# EAGLE design nRF24 Arduino adapter (EAGLE 6.6.0)
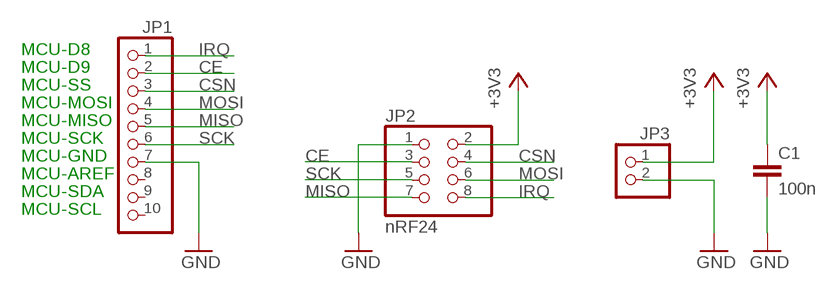
[diagram p0: schematic, sheet 1]

## Parts
C1  100n  C7.5/3  [C7.5B3]
JP1  PINHD-1X10  [1X10]
JP2  nRF24  PINHD-2X4  [2X04]
JP3  PINHD-1X2  [1X02]

## Nets
+3V3: C1.1 JP2.2 JP3.1
CE: JP1.2 JP2.3
CSN: JP1.3 JP2.4
GND: C1.2 JP1.7 JP2.1 JP3.2
IRQ: JP1.1 JP2.8
MISO: JP1.5 JP2.7
MOSI: JP1.4 JP2.6
SCK: JP1.6 JP2.5
Unconnected: JP1.8 JP1.9 JP1.10

## Notes on the sheet
- MCU-D8
- MCU-D9
- MCU-SS
- MCU-MOSI
- MCU-MISO
- MCU-SCK
- MCU-GND
- MCU-AREF
- MCU-SDA
- MCU-SCL

## Library data of the parts
C1 = capacitor-wima:C: CAPACITOR naming: grid - package width
JP1 = pinhead:PINHD-1X10: PIN HEADER
JP2 = pinhead:PINHD-2X4: PIN HEADER
JP3 = pinhead:PINHD-1X2: PIN HEADER

## Board
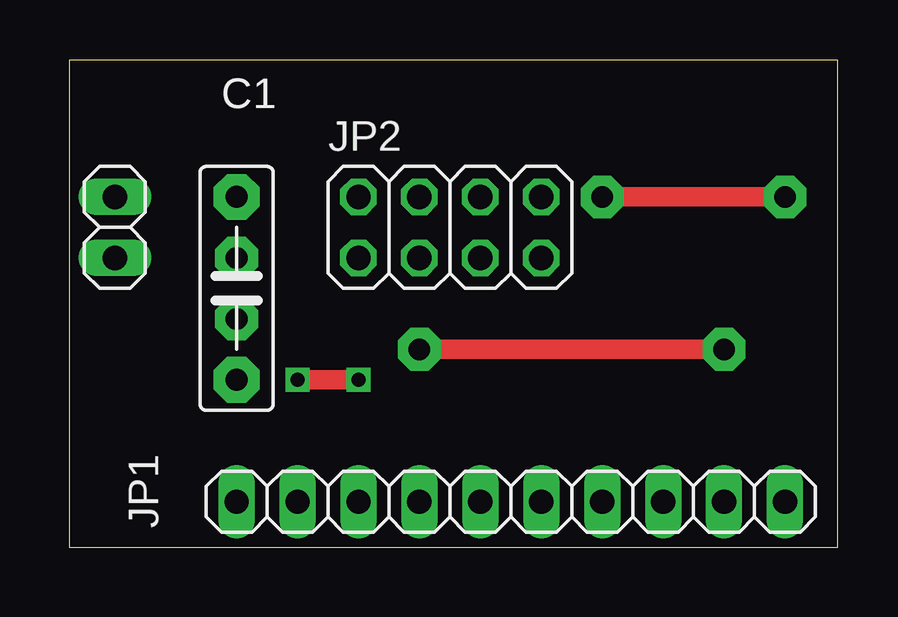
[diagram p1: board, top side]
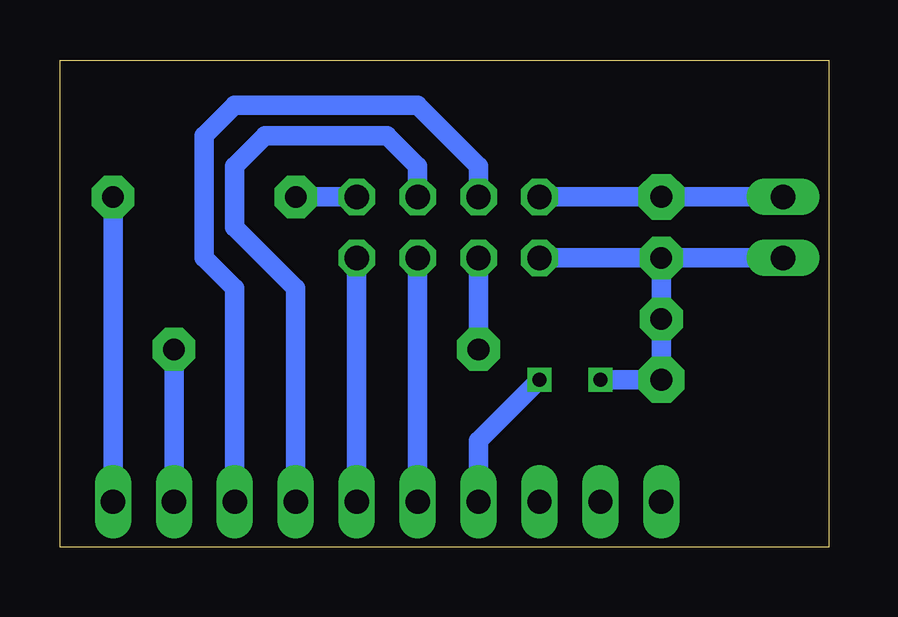
[diagram p2: board, bottom side, seen from below]

Size 32.05 x 20.31 mm. Coordinates in mm from the lower left corner, seen from the top.
Outline: 0,0 32.05,0 32.05,20.31 0,20.31 0,0
Copper layers (1*16): Top 0.035mm / dielectric 1.5mm / Bottom 0.035mm
Design rules "default": minimum track width 10mil, minimum drill 24mil, track to track 8mil, track to pad 8mil, pad to pad 8mil, via to via 8mil, smd to smd 8mil, copper to edge 40mil, drill to drill 8mil, minimum pad ring 10mil, minimum via ring 8mil, stop-mask expansion 4mil, vias tented up to drill 0mil, thermal gap 10mil

### Footprints (pad centres in the part's own frame; a part is rotated, then mirrored left to right if it is on the bottom)
C7.5B3 = drill 0.914 pad 1.905 octagon: 1 -3.81,0; 2 3.81,0
1X10 = drill 1.016 long: 1 -11.43,0; 2 -8.89,0; 3 -6.35,0; 4 -3.81,0; 5 -1.27,0; 6 1.27,0; 7 3.81,0; 8 6.35,0; 9 8.89,0; 10 11.43,0
2X04 = drill 1.016 octagon: 1 -3.81,-1.27; 2 -3.81,1.27; 3 -1.27,-1.27; 4 -1.27,1.27; 5 1.27,-1.27; 6 1.27,1.27; 7 3.81,-1.27; 8 3.81,1.27
1X02 = drill 1.016 long: 1 -1.27,0; 2 1.27,0

### Placement (x,y rotation side)
C1  6.99,10.79 270 top
JP1  18.41,1.91 180 top
JP2  15.88,13.34 0 top
JP3  1.91,13.34 270 top

### Tracks (layer width: path | path; a pad name or v marks a point on that pad's centre or on a via)
+3V3
  Bottom 0.813: JP3.1 C1.1 JP2.2
CE  (via drill 0.9 pad 1.78)
  Top 0.813: v14.61,8.26 v27.3,8.26
  Bottom 0.813: JP2.3 v14.61,8.26 | v27.3,8.26 JP1.2
CSN
  Bottom 0.813: JP2.4 14.61,15.88 17.14,18.41 24.77,18.41 26.04,17.14 26.04,12.06 24.77,10.79 JP1.3
GND  (via drill 0.6, 0.9 pad 1.78)
  Top 0.813: v12.06,6.99 v9.53,6.99
  Bottom 0.813: JP2.1 v6.99,12.06 | v6.99,12.06 JP3.2 | v6.99,12.06 v6.99,9.53 C1.2 v9.53,6.99 | JP1.7 14.61,4.45 v12.06,6.99
IRQ  (via drill 0.9 pad 1.78)
  Top 0.813: v22.23,14.61 v29.84,14.61
  Bottom 0.813: JP2.8 v22.23,14.61 | v29.84,14.61 JP1.1
MISO
  Bottom 0.813: JP1.5 JP2.7
MOSI
  Bottom 0.813: JP1.4 22.23,10.79 24.77,13.34 24.77,15.88 23.5,17.14 18.41,17.14 17.14,15.88 JP2.6
SCK
  Bottom 0.813: JP1.6 JP2.5

### Text on the board
tValues: 3V3 | + | GND | - | GND | D13 | D12 | D11 | D10 | D9 | D8